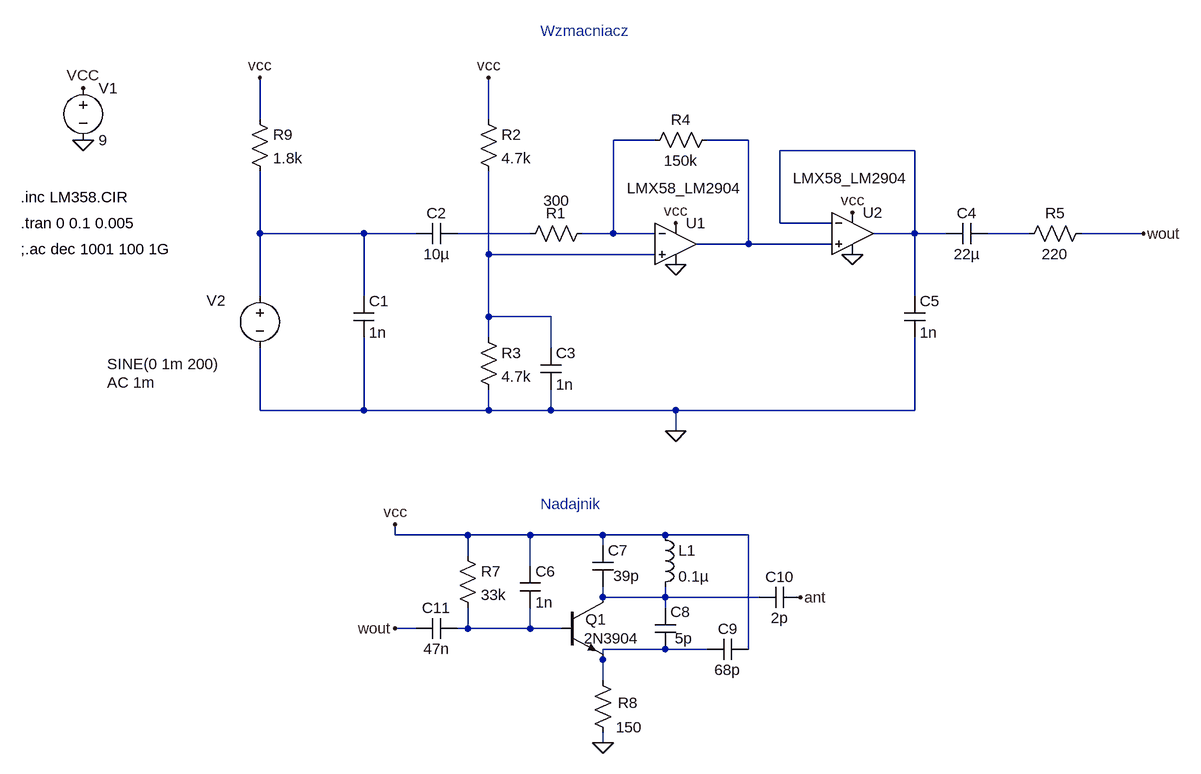
[diagram p0: schematic nadajnik.asc]
nadajnik.asc, the LTspice schematic file:
Version 4
SHEET 1 1584 1576
WIRE 128 496 128 432
WIRE 480 496 480 432
WIRE 736 528 672 528
WIRE 880 528 816 528
WIRE 1136 544 928 544
WIRE 928 656 928 544
WIRE 1008 656 928 656
WIRE 128 672 128 576
WIRE 288 672 128 672
WIRE 368 672 288 672
WIRE 544 672 432 672
WIRE 672 672 672 528
WIRE 672 672 624 672
WIRE 736 672 672 672
WIRE 1136 672 1136 544
WIRE 1136 672 1072 672
WIRE 1184 672 1136 672
WIRE 1312 672 1248 672
WIRE 1488 672 1392 672
WIRE 880 688 880 528
WIRE 880 688 800 688
WIRE 1008 688 880 688
WIRE 480 704 480 576
WIRE 736 704 480 704
WIRE 128 768 128 672
WIRE 288 768 288 672
WIRE 1136 768 1136 672
WIRE 480 800 480 704
WIRE 576 800 480 800
WIRE 480 832 480 800
WIRE 576 848 576 800
WIRE 128 944 128 848
WIRE 288 944 288 832
WIRE 288 944 128 944
WIRE 480 944 480 912
WIRE 480 944 288 944
WIRE 576 944 576 912
WIRE 576 944 480 944
WIRE 768 944 576 944
WIRE 1136 944 1136 832
WIRE 1136 944 768 944
WIRE 768 976 768 944
WIRE 336 1136 336 1120
WIRE 448 1136 336 1136
WIRE 544 1136 448 1136
WIRE 656 1136 544 1136
WIRE 752 1136 656 1136
WIRE 880 1136 752 1136
WIRE 656 1152 656 1136
WIRE 448 1168 448 1136
WIRE 544 1184 544 1136
WIRE 656 1232 656 1216
WIRE 752 1232 752 1216
WIRE 752 1232 656 1232
WIRE 896 1232 752 1232
WIRE 752 1248 752 1232
WIRE 368 1280 336 1280
WIRE 448 1280 448 1248
WIRE 448 1280 432 1280
WIRE 544 1280 544 1248
WIRE 544 1280 448 1280
WIRE 592 1280 544 1280
WIRE 752 1312 656 1312
WIRE 816 1312 752 1312
WIRE 880 1312 880 1136
WIRE 656 1328 656 1312
WIRE 656 1360 656 1328
WIRE 656 1456 656 1440
FLAG -144 448 VCC
FLAG -144 528 0
FLAG 768 656 vcc
FLAG 768 720 0
FLAG 1040 704 0
FLAG 1040 640 vcc
FLAG 768 976 0
FLAG 480 432 vcc
FLAG 656 1456 0
FLAG 960 1232 ant
FLAG 128 432 vcc
FLAG 336 1120 vcc
FLAG 1488 672 wout
FLAG 336 1280 wout
SYMBOL voltage -144 432 R0
WINDOW 123 0 0 Left 0
WINDOW 39 0 0 Left 0
SYMATTR InstName V1
SYMATTR Value 9
SYMBOL OpAmps\\opamp2 768 624 R0
WINDOW 3 -75 -22 Left 2
SYMATTR Value LMX58_LM2904
SYMATTR InstName U1
SYMBOL res 832 512 R90
WINDOW 0 0 56 VBottom 2
WINDOW 3 32 56 VTop 2
SYMATTR InstName R4
SYMATTR Value 150k
SYMBOL res 464 480 R0
SYMATTR InstName R2
SYMATTR Value 4.7k
SYMBOL res 464 816 R0
SYMATTR InstName R3
SYMATTR Value 4.7k
SYMBOL cap 560 848 R0
SYMATTR InstName C3
SYMATTR Value 1n
SYMBOL cap 432 656 R90
WINDOW 0 0 32 VBottom 2
WINDOW 3 32 32 VTop 2
SYMATTR InstName C2
SYMATTR Value 10µ
SYMBOL cap 272 768 R0
SYMATTR InstName C1
SYMATTR Value 1n
SYMBOL OpAmps\\opamp2 1040 608 R0
WINDOW 3 -92 -21 Left 2
SYMATTR Value LMX58_LM2904
SYMATTR InstName U2
SYMBOL cap 1120 768 R0
SYMATTR InstName C5
SYMATTR Value 1n
SYMBOL cap 1248 656 R90
WINDOW 0 0 32 VBottom 2
WINDOW 3 32 32 VTop 2
SYMATTR InstName C4
SYMATTR Value 22µ
SYMBOL res 1408 656 R90
WINDOW 0 0 56 VBottom 2
WINDOW 3 32 56 VTop 2
SYMATTR InstName R5
SYMATTR Value 220
SYMBOL voltage 128 752 R0
WINDOW 0 -82 23 Left 2
WINDOW 3 -235 121 Left 2
WINDOW 123 -235 149 Left 2
WINDOW 39 0 0 Left 0
SYMATTR InstName V2
SYMATTR Value SINE(0 1m 200)
SYMATTR Value2 AC 1m
SYMBOL res 640 656 R90
WINDOW 0 0 56 VBottom 2
WINDOW 3 -50 55 VTop 2
SYMATTR InstName R1
SYMATTR Value 300
SYMBOL res 432 1152 R0
SYMATTR InstName R7
SYMATTR Value 33k
SYMBOL cap 528 1184 R0
SYMATTR InstName C6
SYMATTR Value 1n
SYMBOL cap 640 1152 R0
WINDOW 3 32 47 Left 2
SYMATTR Value 39p
SYMATTR InstName C7
SYMBOL res 640 1344 R0
WINDOW 0 39 50 Left 2
WINDOW 3 36 88 Left 2
SYMATTR InstName R8
SYMATTR Value 150
SYMBOL cap 736 1248 R0
WINDOW 0 24 6 Left 2
WINDOW 3 31 47 Left 2
SYMATTR InstName C8
SYMATTR Value 5p
SYMBOL ind 736 1120 R0
SYMATTR InstName L1
SYMATTR Value 0.1µ
SYMBOL cap 880 1296 R90
WINDOW 0 0 32 VBottom 2
WINDOW 3 32 32 VTop 2
SYMATTR InstName C9
SYMATTR Value 68p
SYMBOL cap 960 1216 R90
WINDOW 0 0 32 VBottom 2
WINDOW 3 32 32 VTop 2
SYMATTR InstName C10
SYMATTR Value 2p
SYMBOL cap 432 1264 R90
WINDOW 0 0 32 VBottom 2
WINDOW 3 32 32 VTop 2
SYMATTR InstName C11
SYMATTR Value 47n
SYMBOL npn 592 1232 R0
WINDOW 0 37 34 Left 2
WINDOW 3 35 63 Left 2
SYMATTR InstName Q1
SYMATTR Value 2N3904
SYMBOL res 112 480 R0
SYMATTR InstName R9
SYMATTR Value 1.8k
TEXT -240 616 Left 2 !.inc LM358.CIR
TEXT -240 656 Left 2 !.tran 0 0.1 0.005
TEXT -240 696 Left 2 !;.ac dec 1001 100 1G
TEXT 560 1088 Left 2 ;Nadajnik
TEXT 560 360 Left 2 ;Wzmacniacz

The netlist it stands for:
* nadajnik.asc
V1 VCC 0 9
XU1 N007 N001 VCC 0 N002 LMX58_LM2904  ; pins In+ In- V+ V- OUT
R4 N002 N001 150k
R2 VCC N007 4.7k
R3 N007 0 4.7k
C3 N007 0 1n
C2 N005 N004 10µ
C1 N004 0 1n
XU2 N002 N003 VCC 0 N003 LMX58_LM2904  ; pins In+ In- V+ V- OUT
C5 N003 0 1n
C4 N006 N003 22µ
R5 wout N006 220
V2 N004 0 SINE(0 1m 200) AC 1m
R1 N001 N005 300
R7 VCC N009 33k
C6 VCC N009 1n
C7 VCC N008 39p
R8 N010 0 150
C8 N008 N010 5p
L1 VCC N008 0.1µ
C9 VCC N010 68p
C10 ant N008 2p
C11 N009 wout 47n
Q1 N008 N009 N010 0 2N3904
R9 VCC N004 1.8k
.model NPN NPN
.model PNP PNP
.lib standard.bjt
.inc LM358.CIR
.tran 0 0.1 0.005
;.ac dec 1001 100 1G
* Nadajnik
* Wzmacniacz
.backanno
.end